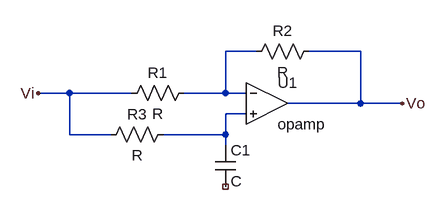
[diagram p0: schematic TS5-Ej1-Circuito Activo.asc]
TS5-Ej1-Circuito Activo.asc, the LTspice schematic file:
Version 4
SHEET 1 880 680
WIRE 272 112 224 112
WIRE 432 112 352 112
WIRE -16 176 -64 176
WIRE 80 176 -16 176
WIRE 224 176 224 112
WIRE 224 176 160 176
WIRE 256 176 224 176
WIRE 432 192 432 112
WIRE 432 192 320 192
WIRE 496 192 432 192
WIRE 256 208 224 208
WIRE -16 240 -16 176
WIRE 48 240 -16 240
WIRE 224 240 224 208
WIRE 224 240 128 240
WIRE 224 256 224 240
FLAG -64 176 Vi
FLAG 496 192 Vo
SYMBOL res 176 160 R90
WINDOW 0 0 56 VBottom 2
WINDOW 3 32 56 VTop 2
SYMATTR InstName R1
SYMBOL res 368 96 R90
WINDOW 0 0 56 VBottom 2
WINDOW 3 32 56 VTop 2
SYMATTR InstName R2
SYMBOL OpAmps\\opamp 288 128 R0
SYMATTR InstName U1
SYMBOL cap 208 256 R0
SYMATTR InstName C1
SYMBOL res 144 224 R90
WINDOW 0 0 56 VBottom 2
WINDOW 3 32 56 VTop 2
SYMATTR InstName R3

The netlist it stands for:
* TS5-Ej1-Circuito Activo.asc
R1 N001 Vi R
R2 Vo N001 R
XU1 N001 N002 Vo opamp Aol=100K GBW=10Meg  ; pins invin noninvin out
C1 N002 NC_01 C
R3 N002 Vi R
.backanno
.end